# EAGLE design oshi-fuse-board-mk-2_mini-ato (EAGLE 6.5.0)
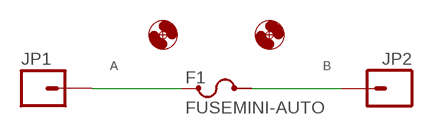
[diagram p0: schematic, sheet 1]

## Parts
F1  FUSEMINI-AUTO  [KEYSTONE-MINI-AUTO-FUSE-HOLDER]
H1  HOLE#4  [HOLE-#4]
H2  HOLE#4  [HOLE-#4]
JP1  M01SCREWITGOOD  [1X01-RING-TERM-6-32-FAT]
JP2  M01SCREWITGOOD  [1X01-RING-TERM-6-32-FAT]

## Nets
A: F1.P1@1 F1.P1@2 JP1.P$1 JP1.P$2 JP1.P$3 JP1.P$4
B: F1.P2@1 F1.P2@2 JP2.P$1 JP2.P$2 JP2.P$3 JP2.P$4

## Library data of the parts
F1 = A_butts:FUSE
H1 H2 = A_butts:HOLE: MOUNTING HOLE with drill center marker
JP1 JP2 = A_butts:M01: Header 1 Standard 1-pin 0.1" header. Use with straight break away headers (SKU : PRT-00116), right angle break away headers (PRT-00553), swiss pins (PRT-00743), machine pins (PRT-00117), and female headers (PRT-00115).

## Board
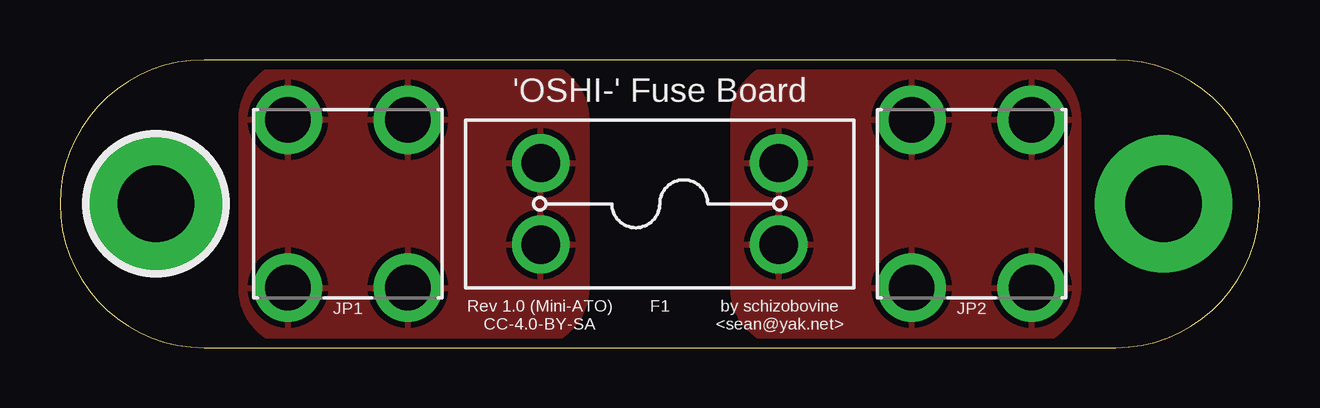
[diagram p1: board, top side]
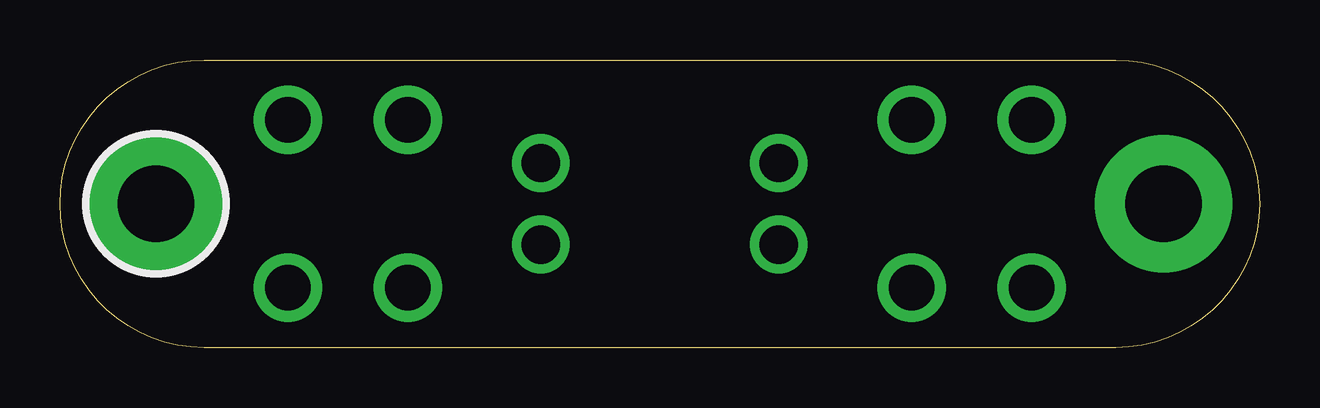
[diagram p2: board, bottom side, seen from below]

Size 50 x 12 mm. Coordinates in mm from the lower left corner, seen from the top.
Outline: 0,6 arc90 6,0 44,0 arc90 50,6 arc90 44,12 6,12 arc90 0,6
Copper layers (1*16): Top 0.0356mm / dielectric 1.5011mm / Bottom 0.0356mm
Design rules "LaenPCBOrder_2": minimum track width 6mil, minimum drill 13mil, track to track 6mil, track to pad 6mil, pad to pad 6mil, via to via 6mil, smd to smd 6mil, copper to edge 15mil, drill to drill 6mil, minimum pad ring 7mil, minimum via ring 7mil, stop-mask expansion 3mil, vias tented up to drill 20mil, thermal gap 10mil

### Footprints (pad centres in the part's own frame; a part is rotated, then mirrored left to right if it is on the bottom)
KEYSTONE-MINI-AUTO-FUSE-HOLDER = drill 1.6: P1@1 -4.96,1.7; P1@2 -4.96,-1.7; P2@1 4.96,1.7; P2@2 4.96,-1.7
HOLE-#4 = drill 3.2 pad 5.715: P$1 0,0
1X01-RING-TERM-6-32-FAT = drill 1.9: P$1 -2.5,3.505; P$2 2.5,3.505; P$3 2.5,-3.505; P$4 -2.5,-3.505

### Placement (x,y rotation side)
F1  25,6 0 top
H1  4,6 0 top
H2  46,6 0 bottom
JP1  12,6 0 top
JP2  38,6 180 top

### Tracks (layer width: path | path; a pad name or v marks a point on that pad's centre or on a via)
A
  pour Top: 19.5,0 10,0 arc-90 7.5,2.5 7.5,9.5 arc-90 10,12 19.5,12 arc-90 22,9.5 22,2.5 arc-90
B
  pour Top: 42.5,2.5 42.5,9.5 arc90 40,12 30.5,12 arc90 28,9.5 28,2.5 arc90 30.5,0 40,0 arc90

### Text on the board
tPlace: 'OSHI-' Fuse Board | Rev 1.0 (Mini-ATO) / CC-4.0-BY-SA | by schizobovine / <sean@yak.net>